# Altium schematic sheet main.SchDoc
size A4
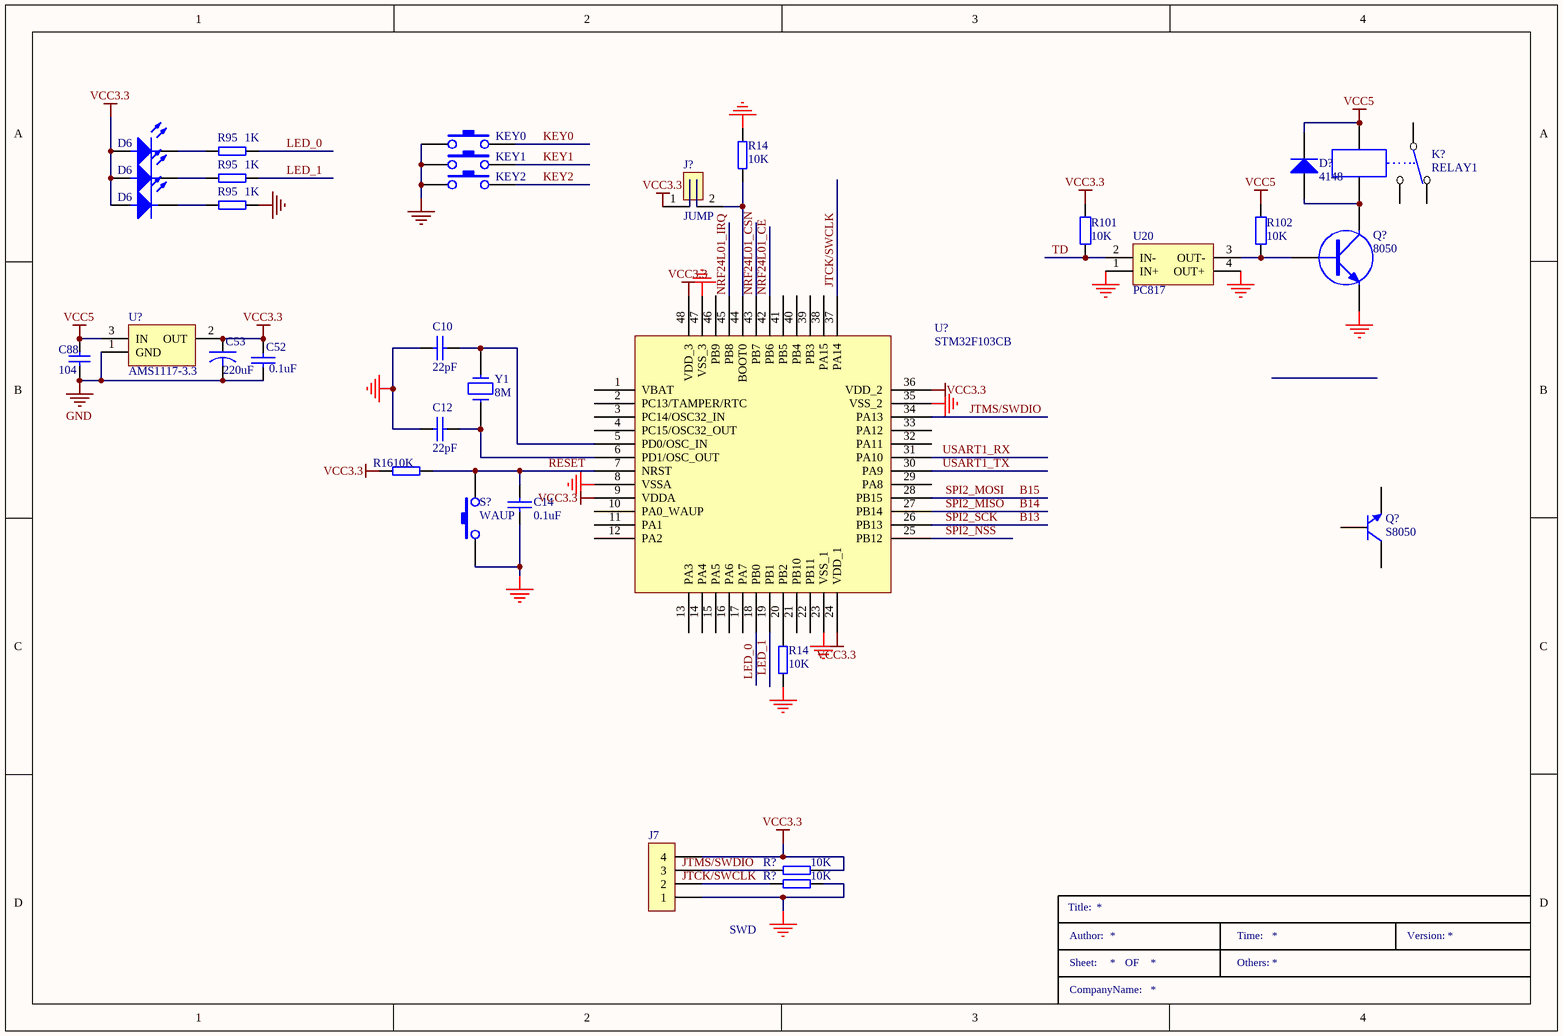
[diagram p0: main.SchDoc]

## Parts
(Parts that share a designator on the sheet are numbered #1, #2 ... from top to bottom, then left to right.)
C10  22pF  [0603]
C12  22pF  [0603]
C14  0.1uF  [0603]
C52  0.1uF  [0603]
C53  220uF  [1206_C]
C88  104  [0603]
D6#1  LED0  [LED3_12]  (value not drawn)
D6#2  LED0  [LED3_12]  (value not drawn)
D6#3  LED0  [LED3_12]  (value not drawn)
D?  4148  [0805_LED12]
J7  SWD  [SIP4-S_1.25MM]
J?  JUMP
K?  RELAY1  [G2R-1-DC12V]
KEY0  KEY0  [KEY_6X6MM]  (value not drawn)
KEY1  KEY1  [KEY_6X6MM]  (value not drawn)
KEY2  KEY2  [KEY_6X6MM]  (value not drawn)
Q?#1  8050  [SOT-23_8050]
Q?#2  S8050  [TO-92A]
R14#1  10K  [0603]
R14#2  10K  [0603]
R16  10K  [0603]
R95#1  1K  [0603]
R95#2  1K  [0603]
R95#3  1K  [0603]
R101  10K  [0603]
R102  10K  [0603]
R?#1  10K  [0603]
R?#2  10K  [0603]
S?  WAUP  [KEY_6X6MM]
U20  PC817  [PC817B]
U?#1  AMS1117-3.3
U?#2  STM32F103CB  [LQFP48]
Y1  8M  [XT_5032]

## Nets
GND: C10.2 C12.2 C14.2 C52.2 C53.2 C88.2 J7.1 KEY0.1 KEY1.1 KEY2.1 Q?#1.3(E) R14#1.1 R14#2.1 R95#3.2 R?#2.1 S?.1 U20.1(IN+) U20.4(OUT+) U?#1.1(GND) U?#2.8(VSSA) U?#2.23(VSS_1) U?#2.35(VSS_2) U?#2.47(VSS_3)
VCC3.3: C52.1 C53.1 D6#1.1(A) D6#2.1(A) D6#3.1(A) J7.4 J?.1 R16.1 R101.1 R?#1.1 U?#1.2(OUT) U?#2.9(VDDA) U?#2.24(VDD_1) U?#2.36(VDD_2) U?#2.48(VDD_3)
VCC5: C88.1 D?.2(K) K?.1 R102.1 U?#1.3(IN)
B13: U?#2.26(PB13)  [also labelled SPI2_SCK]
B14: U?#2.27(PB14)  [also labelled SPI2_MISO]
B15: U?#2.28(PB15)  [also labelled SPI2_MOSI]
JTCK/SWCLK: U?#2.37(PA14)
JTMS/SWDIO: U?#2.34(PA13)
KEY0: KEY0.2
KEY1: KEY1.2
KEY2: KEY2.2
LED_0: R95#1.2 U?#2.18(PB0)
LED_1: R95#2.2 U?#2.19(PB1)
NRF24L01_CE: U?#2.42(PB6)
NRF24L01_CSN: U?#2.43(PB7)
NRF24L01_IRQ: U?#2.45(PB8)
RESET: C14.1 R16.2 S?.2 U?#2.7(NRST)
SPI2_NSS: U?#2.25(PB12)
TD: R101.2 U20.2(IN-)
USART1_RX: U?#2.31(PA10)
USART1_TX: U?#2.30(PA9)
NetC10_1: C10.1 U?#2.5(PD0/OSC_IN) Y1.1
NetC12_1: C12.1 U?#2.6(PD1/OSC_OUT) Y1.2
NetD6#1_2: D6#1.2(K) R95#1.1
NetD6#2_2: D6#2.2(K) R95#2.1
NetD6#3_2: D6#3.2(K) R95#3.1
NetD?_1: D?.1(A) K?.5 Q?#1.2(C)
NetJ7_2: J7.2 R?#2.2
NetJ7_3: J7.3 R?#1.2
NetJ?_2: J?.2 R14#1.2 U?#2.44(BOOT0)
NetQ?#1_1: Q?#1.1(B) R102.2 U20.3(OUT-)
NetR14#2_2: R14#2.2 U?#2.20(PB2)

Not connected (* = marked no-connect by the designer): K? 2 3 4(1); Q?#2 1(E) 2(B) 3(C); U?#2 1(VBAT) 2(PC13/TAMPER/RTC) 3(PC14/OSC32_IN) 4(PC15/OSC32_OUT) 10(PA0_WAUP) 11(PA1) 12(PA2) 13(PA3) 14(PA4) 15(PA5) 16(PA6) 17(PA7) 21(PB10) 22(PB11) 29(PA8) 32(PA11) 33(PA12) 38(PA15) 39(PB3) 40(PB4) 41(PB5) 46(PB9)

## Notes on the sheet
- Labels drawn without touching a wire or pin: JTCK/SWCLK, JTMS/SWDIO
- Title:
- Author:
- Sheet:
- OF
- Time:
- Others:
- Version:
- CompanyName:

## Library data of the parts
C10 C12 C14 = CAP: Capacitor
C52 = CAP
C53 = CAPACITOR
C88 = Cap_4.7pF_NPO_-+0.25pF_0402: Capacitor, 4.7pF, 50V, NPO, -+0.25pF, 0402, YAGEO; Manuf_Part_1: CC0402CRNPO9BN4R7; Value: 10pF; Order: 311-1367-2-ND; Revision: July-2002: Re-released for DXP Platform.; Manuf_1: YAGEO; ECCN_US/EU: n/a; Distrib: DIGIKEY
D6#1-D6#3 = LED
D? = Diode: Default Diode; Published: 8-Jun-2000; LatestRevisionDate: 17-Jul-2002; LatestRevisionNote: Re-released for DXP Platform.; PackageVersion: Sep-1996; PackageReference: SMC; Publisher: Altium Limited; PackageDescription: DO-214-AB/SMC; 2 C-Bend Leads; Body 7.9 x 5.9 mm, inc. leads (LxW); Code_JEDEC: DO-214-AB
J7 = CON4: Connector
K? = RELAY-SPDT
KEY0-KEY2 S? = SW-PB
Q?#1 = NPN: NPN Transistor
Q?#2 = 2N3904: NPN General Purpose Amplifier; Published: 8-Jun-2000; LatestRevisionDate: 15-Jan-2003; LatestRevisionNote: PCB Footprint 'BCY-W3/D4.7' replaced; DatasheetVersion: 1997; PackageVersion: Sep-1998; PackageReference: TO-92A; Publisher: Altium Limited; PackageDescription: TO, Flat Index; 3 In-Line, Axial Leads; Body Dia. 4.5mm; Leads 0.51 x 0.48 mm (max); ComponentLink1Description: Manufacturer Link; ComponentLink1URL: http://www.fairchildsemi.com/; ComponentLink2Description: Datasheet; ComponentLink2URL: http://www.fairchildsemi.com/ds/2N%2F2N3904.pdf
R14#1 R14#2 R16 R95#1-R95#3 R?#1 R?#2 = R
R101 R102 = Res2: Resistor; Published: 8-Jun-2000; LatestRevisionDate: 17-Jul-2002; LatestRevisionNote: Re-released for DXP Platform.; PackageReference: AXIAL-0.4; Publisher: Altium Limited; PackageDescription: Axial Device, Thru-Hole; 2 Leads; 0.4 in Pin Spacing; Value: 10K
U20 = PC817B
U?#1 = AMS1117
Y1 = CRYSTAL